# EAGLE design motherboard (EAGLE 5.02)
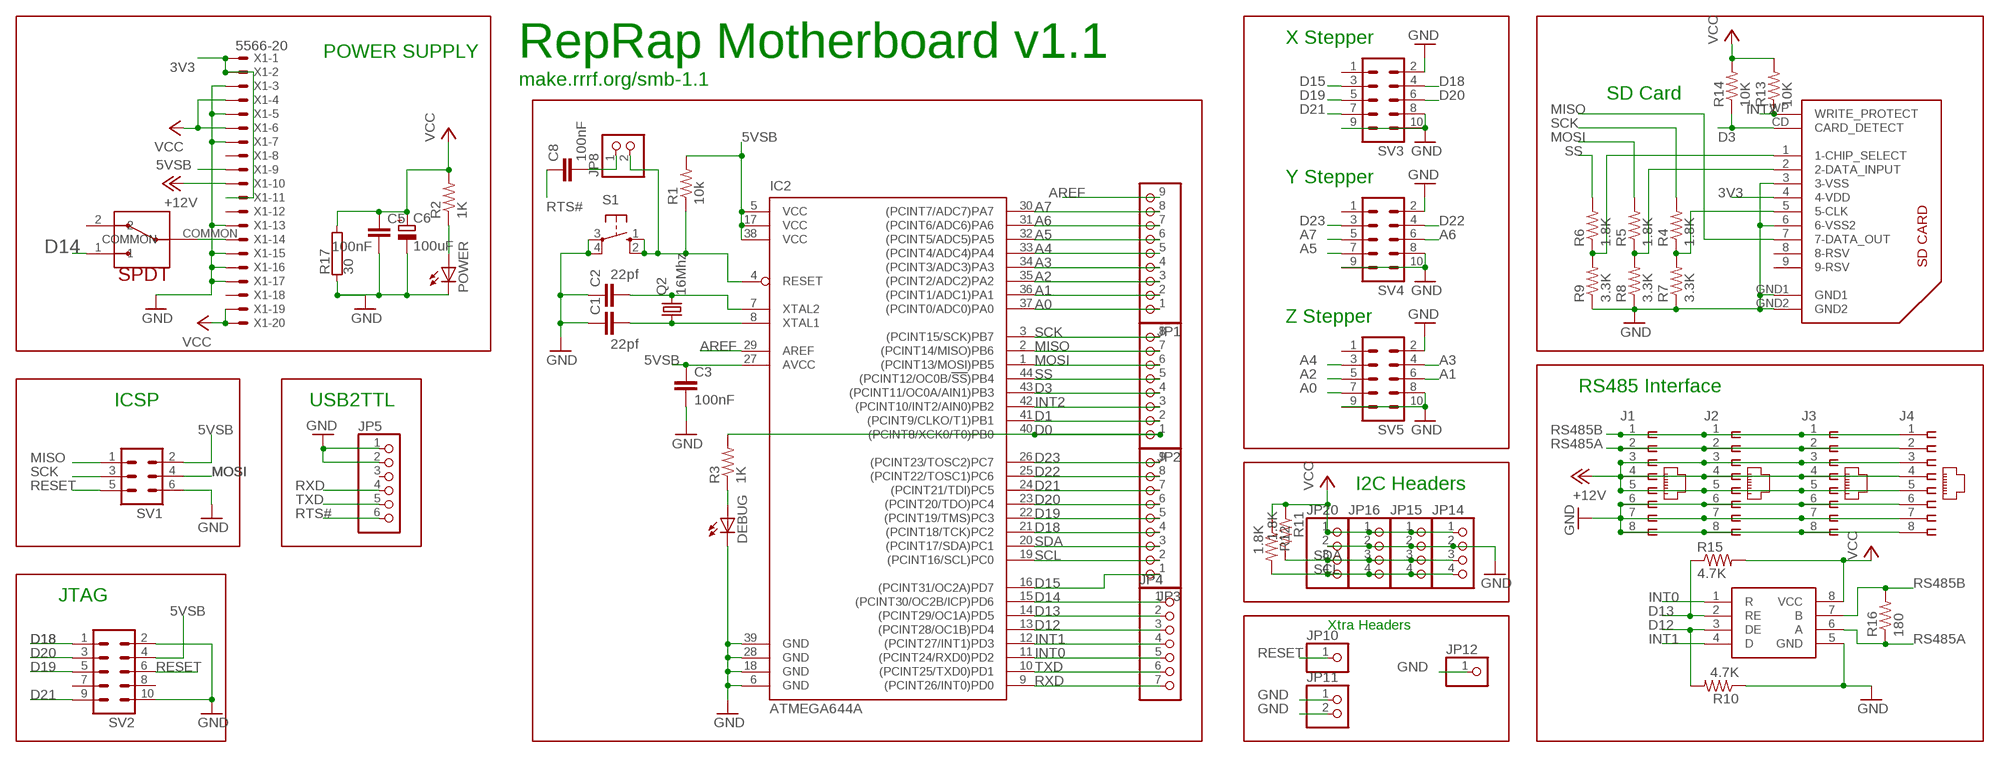
[diagram p0: schematic, sheet 1]

## Parts
C1  22pf  C-EUC1206  [C1206]
C2  22pf  C-EUC1206  [C1206]
C3  100nF  C-EUC1206  [C1206]
C5  100nF  C-EUC1206  [C1206]
C6  100uF  CPOL-EUSANYO_SMD_B6  [SANYO-OSCON_SMD_B6]
C8  100nF  C-EUC1206  [C1206]
DEBUG  LEDCHIPLED_1206  [CHIPLED_1206]
IC1  SN75176ASOIC  [SO08]
IC2  ATMEGA644A  [TQFP44]
J1  555164-1  [555164-1]
J2  555164-1  [555164-1]
J3  555164-1  [555164-1]
J4  555164-1  [555164-1]
JP1  PINHD-1X9  [1X09]
JP2  PINHD-1X8  [1X08]
JP3  PINHD-1X9  [1X09]
JP4  PINHD-1X7  [1X07]
JP5  PINHD-1X6  [1X06]
JP8  PINHD-1X2  [1X02]
JP10  PINHD-1X1  [1X01]
JP11  PINHD-1X2  [1X02]
JP12  PINHD-1X1  [1X01]
JP14  PINHD-1X4  [1X04]
JP15  PINHD-1X4  [1X04]
JP16  PINHD-1X4  [1X04]
JP20  PINHD-1X4  [1X04]
POWER  LEDCHIPLED_1206  [CHIPLED_1206]
Q2  16Mhz  CRYSTALHC49UV  [HC49U-V]
R1  10k  R-US_R1206  [R1206]
R2  1K  R-US_R1206  [R1206]
R3  1K  R-US_R1206  [R1206]
R4  1.8K  R-US_R1206  [R1206]
R5  1.8K  R-US_R1206  [R1206]
R6  1.8K  R-US_R1206  [R1206]
R7  3.3K  R-US_R1206  [R1206]
R8  3.3K  R-US_R1206  [R1206]
R9  3.3K  R-US_R1206  [R1206]
R10  4.7K  R-US_R1206  [R1206]
R11  1.8K  R-US_R1206  [R1206]
R12  1.8K  R-US_R1206  [R1206]
R13  10K  R-US_R1206  [R1206]
R14  10K  R-US_R1206  [R1206]
R15  4.7K  R-US_R1206  [R1206]
R16  180  R-US_R1206  [R1206]
R17  30  RKH206-8  [KH206-8]
S1  10-XX  [B3F-10XX]
SV1  ML6  [ML6]
SV2  ML10  [ML10]
SV3  ML10  [ML10]
SV4  ML10  [ML10]
SV5  ML10  [ML10]
U$2  SPDT  [10SP001]
U$8  SDCARD  [3M-SDCARD]
X1  5566-20  [5566-20]

## Nets
3V3: U$8.4(4-VDD) X1.1 X1.2 X1.11
5VSB: C3.1 IC2.5(VCC) IC2.17(VCC) IC2.27(AVCC) IC2.38(VCC) R1.2 SV1.2 SV2.4 X1.9
+12V: J1.3 J1.4 J1.5 J2.3 J2.4 J2.5 J3.3 J3.4 J3.5 J4.3 J4.4 J4.5 X1.10
A0: IC2.37((PCINT0/ADC0)PA0) JP1.1 SV5.7
A1: IC2.36((PCINT1/ADC1)PA1) JP1.2 SV5.6
A2: IC2.35((PCINT2/ADC2)PA2) JP1.3 SV5.5
A3: IC2.34((PCINT3/ADC3)PA3) JP1.4 SV5.4
A4: IC2.33((PCINT4/ADC4)PA4) JP1.5 SV5.3
A5: IC2.32((PCINT5/ADC5)PA5) JP1.6 SV4.7
A6: IC2.31((PCINT6/ADC6)PA6) JP1.7 SV4.6
A7: IC2.30((PCINT7/ADC7)PA7) JP1.8 SV4.5
AREF: IC2.29(AREF) JP1.9
D0: IC2.40((PCINT8/XCK0/T0)PB0) JP2.1 R3.2
D1: IC2.41((PCINT9/CLKO/T1)PB1) JP2.2
D3: IC2.43((PCINT11/OC0A/AIN1)PB3) JP2.4 R14.1 U$8.CD(CARD_DETECT)
D12: IC1.3(DE) IC2.13((PCINT28/OC1B)PD4) JP4.3 R10.2
D13: IC1.2(RE) IC2.14((PCINT29/OC1A)PD5) JP4.2 R15.1
D14: IC2.15((PCINT30/OC2B/ICP)PD6) JP4.1 U$2.1
D15: IC2.16((PCINT31/OC2A)PD7) JP3.1 SV3.3
D18: IC2.21((PCINT18/TCK)PC2) JP3.4 SV2.1 SV3.4
D19: IC2.22((PCINT19/TMS)PC3) JP3.5 SV2.5 SV3.5
D20: IC2.23((PCINT20/TDO)PC4) JP3.6 SV2.3 SV3.6
D21: IC2.24((PCINT21/TDI)PC5) JP3.7 SV2.9 SV3.7
D22: IC2.25((PCINT22/TOSC1)PC6) JP3.8 SV4.4
D23: IC2.26((PCINT23/TOSC2)PC7) JP3.9 SV4.3
GND [power]: C1.1 C2.1 C3.2 C5.2 C6.- DEBUG.C IC1.5(GND) IC2.6(GND) IC2.18(GND) IC2.28(GND) IC2.39(GND) J1.6 J1.7 J1.8 J2.6 J2.7 J2.8 J3.6 J3.7 J3.8 J4.6 J4.7 J4.8 JP5.1 JP5.2 JP11.1 JP11.2 JP12.1 JP14.2 JP15.2 JP16.2 JP20.2 POWER.C R7.1 R8.1 R9.1 R10.1 R17.1 S1.3(P) S1.4(P1) SV1.6 SV2.2 SV2.10 SV3.2 SV3.8 SV3.9 SV3.10 SV4.2 SV4.8 SV4.9 SV4.10 SV5.2 SV5.8 SV5.9 SV5.10 U$8.3(3-VSS) U$8.6(6-VSS2) U$8.GND1 U$8.GND2 X1.3 X1.5 X1.7 X1.13 X1.15 X1.16 X1.17
INT0: IC1.1(R) IC2.11((PCINT24/RXD0)PD2) JP4.5
INT1: IC1.4(D) IC2.12((PCINT27/INT1)PD3) JP4.4
INT2: IC2.42((PCINT10/INT2/AIN0)PB2) JP2.3 R13.1 U$8.WP(WRITE_PROTECT)
MISO: IC2.2((PCINT14/MISO)PB6) JP2.7 SV1.1 U$8.7(7-DATA_OUT)
MOSI: IC2.1((PCINT13/MOSI)PB5) JP2.6 R5.2 SV1.4
N$1: C2.2 IC2.7(XTAL2) Q2.2
N$4: POWER.A R2.1
N$5: U$2.COMMON X1.14
N$7: DEBUG.A R3.1
N$8: C1.2 IC2.8(XTAL1) Q2.1
N$14: R6.1 R9.2 U$8.1(1-CHIP_SELECT)
N$17: R5.1 R8.2 U$8.2(2-DATA_INPUT)
N$21: C8.2 JP8.1
N$23: R4.1 R7.2 U$8.5(5-CLK)
RESET: IC2.4(RESET) JP8.2 JP10.1 R1.1 S1.1(S) S1.2(S1) SV1.5 SV2.6
RS485A: IC1.6(A) J1.2 J2.2 J3.2 J4.2 R16.1
RS485B: IC1.7(B) J1.1 J2.1 J3.1 J4.1 R16.2
RTS#: C8.1 JP5.6
RXD: IC2.9((PCINT26/INT0)PD0) JP4.7 JP5.4
SCK: IC2.3((PCINT15/SCK)PB7) JP2.8 R4.2 SV1.3
SCL: IC2.19((PCINT16/SCL)PC0) JP3.2 JP14.4 JP15.4 JP16.4 JP20.4 R12.2
SDA: IC2.20((PCINT17/SDA)PC1) JP3.3 JP14.3 JP15.3 JP16.3 JP20.3 R11.2
SS: IC2.44((PCINT12/OC0B/!SS!)PB4) JP2.5 R6.2
TXD: IC2.10((PCINT25/TXD0)PD1) JP4.6 JP5.5
VCC [power]: C5.1 C6.+ IC1.8(VCC) JP14.1 JP15.1 JP16.1 JP20.1 R2.2 R11.1 R12.1 R13.2 R14.2 R15.2 R17.2 X1.4 X1.6 X1.19 X1.20
Unconnected: JP5.3 SV2.7 SV2.8 SV3.1 SV4.1 SV5.1 U$2.2 U$8.8(8-RSV) U$8.9(9-RSV) X1.8 X1.12 X1.18

## Notes on the sheet
- X Stepper
- POWER SUPPLY | RepRap Motherboard v1.1
- make.rrrf.org/smb-1.1
- SD Card
- Y Stepper
- Z Stepper
- RS485 Interface
- ICSP | USB2TTL
- I2C Headers
- JTAG
- Xtra Headers

## Library data of the parts
C1-C3 C5 C8 = rcl:C-EU: CAPACITOR, European symbol
C6 = rcl:CPOL-EU: POLARIZED CAPACITOR, European symbol
DEBUG POWER = led:LED: LED OSRAM: - CHIPLED LG R971, LG N971, LY N971, LG Q971, LY Q971, LO R971, LY R971 LH N974, LH R974 LS Q976, LO Q976, LY Q976 LO Q996 - Hyper CHIPLED LW Q18S LB Q993, LB Q99A, LB R99A - SideLED LS A670, LO A670, LY A670, LG A670, LP A670 LB A673, LV A673, LT A673, LW A673 LH A674 LY A675 LS A676, LA A676, LO A676, LY A676, LW A676 LS A679, LY A679, LG A679 - Hyper Micro SIDELED® LS Y876, LA Y876, LO Y876, LY Y876 LT Y87S - SmartLED LW L88C, LW L88S LB L89C, LB L89S, LG L890 LS L89K, LO L89K, LY L89K LS L896, LA L896, LO L896, LY L896 - TOPLED LS T670, LO T670, LY T670, LG T670, LP T670 LSG T670, LSP T670, LSY T670, LOP T670, LYG T670 LG T671, LOG T671, LSG T671 LB T673, LV T673, LT T673, LW T673 LH T674 LS T676, LA T676, LO T676, LY T676, LB T676, LH T676, LSB T676, LW T676 LB T67C, LV T67C, LT T67C, LS T67K, LO T67K, LY T67K, LW E67C LS E67B, LA E67B, LO E67B, LY E67B, LB E67C, LV E67C, LT E67C LW T67C LS T679, LY T679, LG T679 LS T770, LO T770, LY T770, LG T770, LP T770 LB T773, LV T773, LT T773, LW T773 LH T774 LS E675, LA E675, LY E675, LS T675 LS T776, LA T776, LO T776, LY T776, LB T776 LHGB T686 LT T68C, LB T68C - Hyper Mini TOPLED® LB M676 - Mini TOPLED Santana® LG M470 LS M47K, LO M47K, LY M47K Source: http://www.osram.convergy.de - LUMILED® LXK2-PW12-R00, LXK2-PW12-S00, LXK2-PW14-U00, LXK2-PW14-V00 LXK2-PM12-R00, LXK2-PM12-S00, LXK2-PM14-U00 LXK2-PE12-Q00, LXK2-PE12-R00, LXK2-PE12-S00, LXK2-PE14-T00, LXK2-PE14-U00 LXK2-PB12-K00, LXK2-PB12-L00, LXK2-PB12-M00, LXK2-PB14-N00, LXK2-PB14-P00, LXK2-PB14-Q00 LXK2-PR12-L00, LXK2-PR12-M00, LXK2-PR14-Q00, LXK2-PR14-R00 LXK2-PD12-Q00, LXK2-PD12-R00, LXK2-PD12-S00 LXK2-PH12-R00, LXK2-PH12-S00 LXK2-PL12-P00, LXK2-PL12-Q00, LXK2-PL12-R00 Source: www.luxeon.com
IC1 = reprap:SN75176A
IC2 = atmel:ATMEGA644: 8-bit Microcontroller with 64K Bytes In-System Programmable Flash Source: http://www.atmel.com/dyn/resources/prod_documents/doc2593.pdf
J1-J4 = con-amp:555164-1: AMP connector
JP1 JP3 = pinhead:PINHD-1X9: PIN HEADER
JP2 = pinhead:PINHD-1X8: PIN HEADER
JP4 = pinhead:PINHD-1X7: PIN HEADER
JP5 = pinhead:PINHD-1X6: PIN HEADER
JP8 JP11 = pinhead:PINHD-1X2: PIN HEADER
JP10 JP12 = pinhead:PINHD-1X1: PIN HEADER
JP14-JP16 JP20 = pinhead:PINHD-1X4: PIN HEADER
Q2 = SparkFun:CRYSTAL: Crystals Various standard crystals. Proven footprints. Spark Fun Electronics SKU : COM-00534
R1 R2 R10-R16 = rcl:R-US_: RESISTOR, American symbol
R3-R9 = resistor:R-US_: RESISTOR, American symbol
R17 = resistor-power:R: Power Resitor
S1 = switch-omron:10-XX: OMRON SWITCH
SV1 = con-harting-ml:ML6: HARTING
SV2 SV3 = con-harting-ml:ML10: HARTING
SV4 SV5 = con-ml:ML10: HARTING
U$2 = nycr:SPDT
U$8 = reprap:SDCARD
X1 = con-molex:5566-20: Mini FIT connector 20 pol ATX PC-Motherboard Power connector Source: http://www.molex.com

## Net classes
0 default: width 0.406 mm, clearance 0.305 mm
1 power: width 0.635 mm, clearance 0.406 mm

## Board
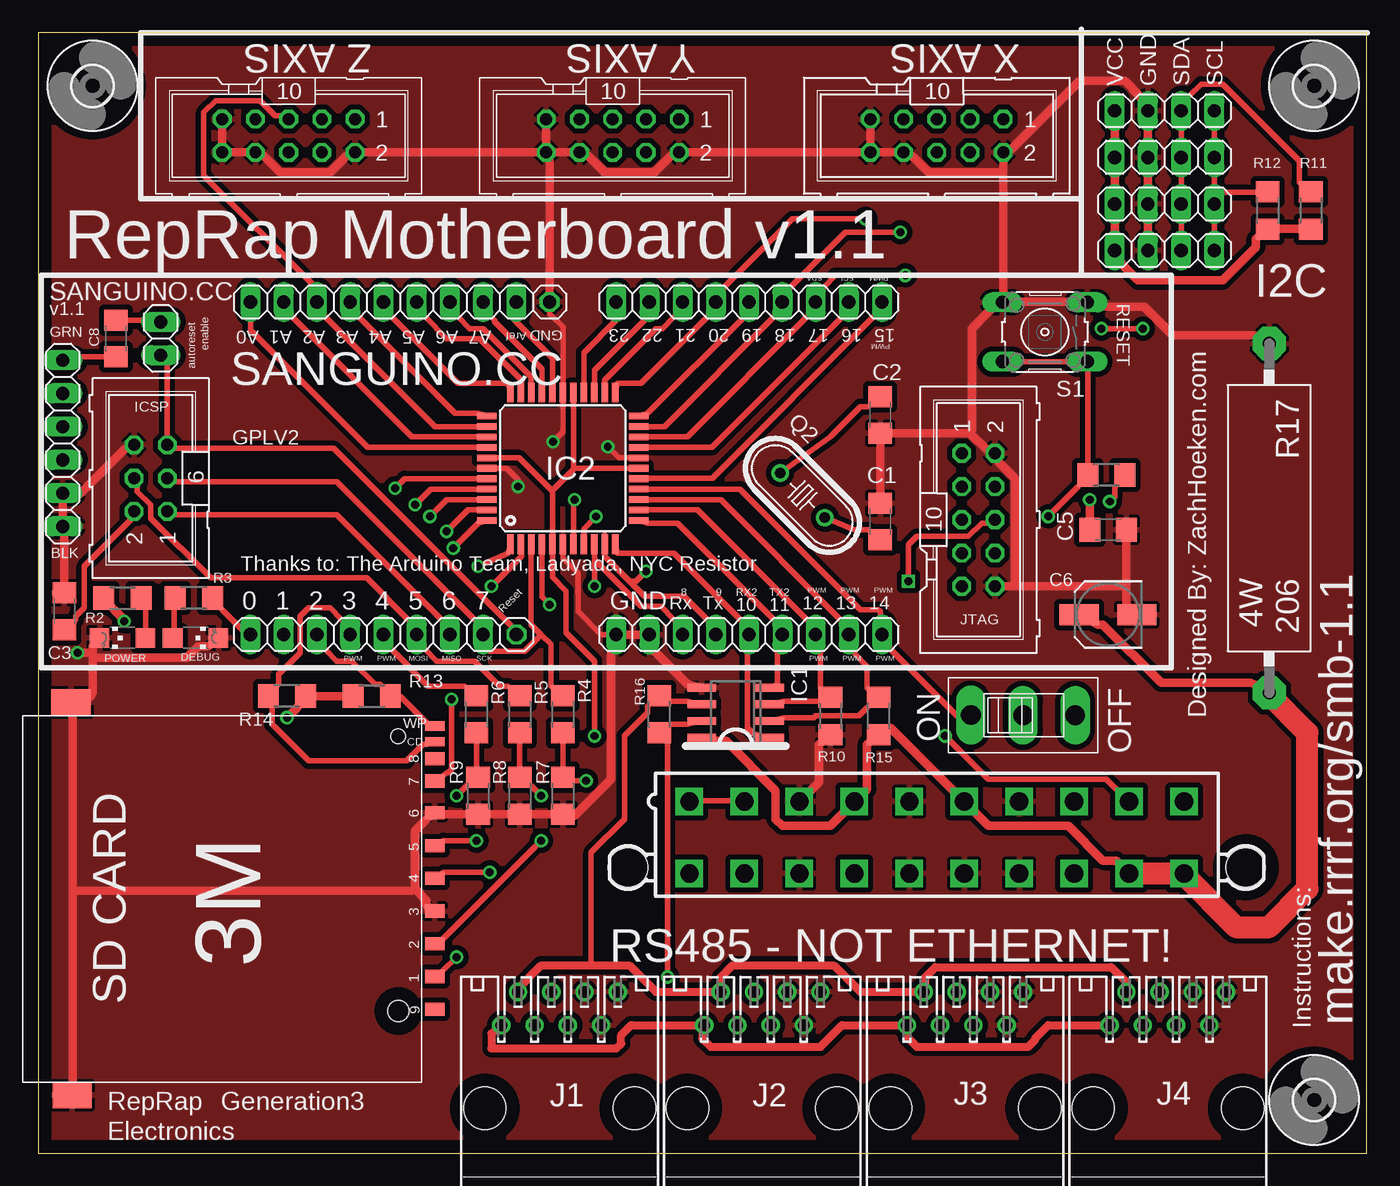
[diagram p1: board, top side]
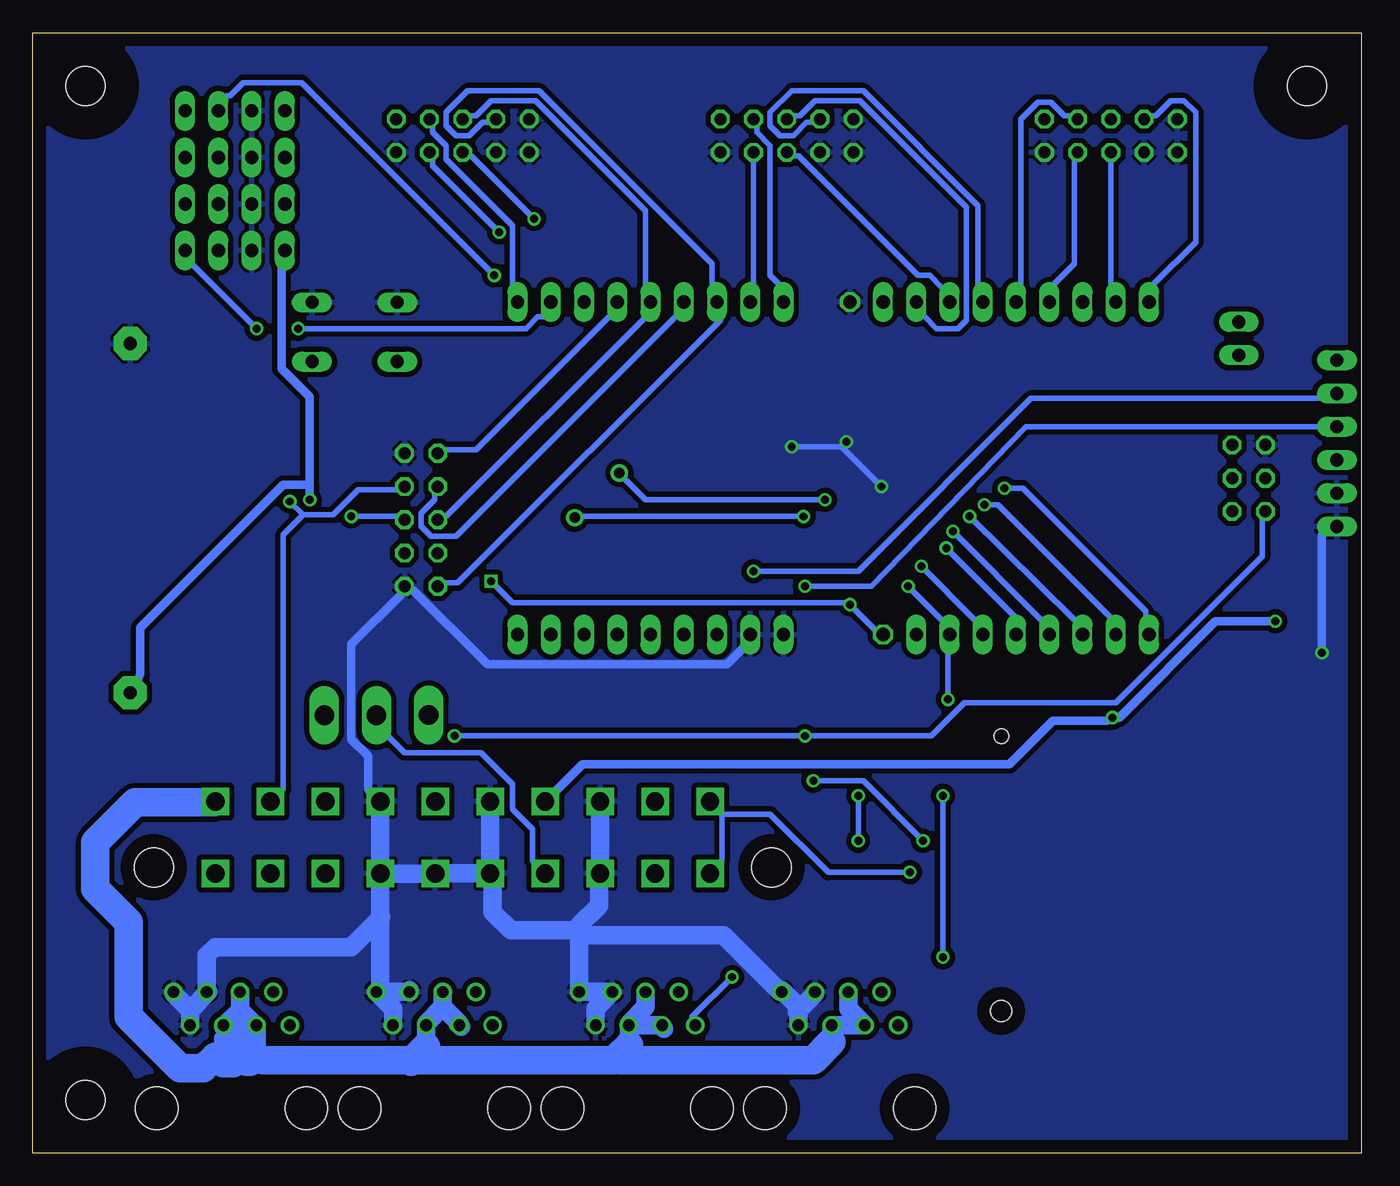
[diagram p2: board, bottom side, seen from below]

Size 101.52 x 85.59 mm. Coordinates in mm from the lower left corner, seen from the top.
Outline: 0,0 101.52,0 101.52,85.59 0,85.59 0,0
Copper layers (1*16): Top 0.035mm / dielectric 1.5mm / Bottom 0.035mm
Design rules "default *": minimum track width 10mil, minimum drill 24mil, track to track 8mil, track to pad 8mil, pad to pad 8mil, via to via 8mil, smd to smd 8mil, copper to edge 40mil, drill to drill 8mil, minimum pad ring 10mil, minimum via ring 8mil, stop-mask expansion 4mil, vias tented up to drill 0mil, thermal gap 10mil

### Footprints (pad centres in the part's own frame; a part is rotated, then mirrored left to right if it is on the bottom)
C1206 = smd 1.6 x 1.8: 1 -1.4,0; 2 1.4,0
SANYO-OSCON_SMD_B6 = smd 3 x 1.6: + 2.2,0; - -2.2,0
CHIPLED_1206 = smd 1.5 x 1.5: A 0,-1.75; C 0,1.75
SO08 = smd 0.6 x 2.2: 1 -1.905,-2.6; 2 -0.635,-2.6; 3 0.635,-2.6; 4 1.905,-2.6; 5 1.905,2.6; 6 0.635,2.6; 7 -0.635,2.6; 8 -1.905,2.6
TQFP44 = smd 1.5 x 0.5: 1 -5.8,4; 2 -5.8,3.2; 3 -5.8,2.4; 4 -5.8,1.6; 5 -5.8,0.8; 6 -5.8,0; 7 -5.8,-0.8; 8 -5.8,-1.6; 9 -5.8,-2.4; 10 -5.8,-3.2; 11 -5.8,-4; 23 5.8,-4; 24 5.8,-3.2; 25 5.8,-2.4; 26 5.8,-1.6; 27 5.8,-0.8; 28 5.8,0; 29 5.8,0.8; 30 5.8,1.6; 31 5.8,2.4; 32 5.8,3.2; 33 5.8,4 | smd 0.5 x 1.5: 12 -4,-5.8; 13 -3.2,-5.8; 14 -2.4,-5.8; 15 -1.6,-5.8; 16 -0.8,-5.8; 17 0,-5.8; 18 0.8,-5.8; 19 1.6,-5.8; 20 2.4,-5.8; 21 3.2,-5.8; 22 4,-5.8; 34 4,5.8; 35 3.2,5.8; 36 2.4,5.8; 37 1.6,5.8; 38 0.8,5.8; 39 0,5.8; 40 -0.8,5.8; 41 -1.6,5.8; 42 -2.4,5.8; 43 -3.2,5.8; 44 -4,5.8
555164-1 = drill 0.889 round: 1 -4.445,5.207; 2 -3.175,7.747; 3 -1.905,5.207; 4 -0.635,7.747; 5 0.635,5.207; 6 1.905,7.747; 7 3.175,5.207; 8 4.445,7.747 | hole 3.251: -5.715,-1.143; 5.715,-1.143
1X09 = drill 1.016 long: 1 -10.16,0; 2 -7.62,0; 3 -5.08,0; 4 -2.54,0; 5 0,0; 6 2.54,0; 7 5.08,0; 8 7.62,0; 9 10.16,0
1X08 = drill 1.016 long: 1 -8.89,0; 2 -6.35,0; 3 -3.81,0; 4 -1.27,0; 5 1.27,0; 6 3.81,0; 7 6.35,0; 8 8.89,0
1X07 = drill 1.016 long: 1 -7.62,0; 2 -5.08,0; 3 -2.54,0; 4 0,0; 5 2.54,0; 6 5.08,0; 7 7.62,0
1X06 = drill 1.016 long: 1 -6.35,0; 2 -3.81,0; 3 -1.27,0; 4 1.27,0; 5 3.81,0; 6 6.35,0
1X02 = drill 1.016 long: 1 -1.27,0; 2 1.27,0
1X01 = drill 1.016 octagon: 1 0,0
1X04 = drill 1.016 long: 1 -3.81,0; 2 -1.27,0; 3 1.27,0; 4 3.81,0
HC49U-V = drill 0.813 round: 1 -2.413,0; 2 2.413,0
R1206 = smd 1.6 x 1.803: 1 -1.422,0; 2 1.422,0
KH206-8 = drill 1.016 pad 2.54 octagon: 1 -13.335,0; 2 13.335,0
B3F-10XX = drill 1.016 long: 1 -3.251,2.261; 2 3.251,2.261; 3 -3.251,-2.261; 4 3.251,-2.261
ML6 = drill 0.914 octagon: 1 -2.54,-1.27; 2 -2.54,1.27; 3 0,-1.27; 4 0,1.27; 5 2.54,-1.27; 6 2.54,1.27
ML10 = drill 0.914 octagon: 1 -5.08,-1.27; 2 -5.08,1.27; 3 -2.54,-1.27; 4 -2.54,1.27; 5 0,-1.27; 6 0,1.27; 7 2.54,-1.27; 8 2.54,1.27; 9 5.08,-1.27; 10 5.08,1.27
10SP001 = drill 1.5 long: 1 1.71,2.86; 2 9.69,2.85; COMMON 5.7,2.85
3,0 = hole 3: 0,0
3M-SDCARD = smd 1 x 1.5: 1 5.93,16.5; 2 3.43,16.5; 3 0.93,16.5; 4 -1.57,16.5; 5 -4.07,16.5; 6 -6.57,16.5; 7 -9,16.5; 8 -10.7,16.5; 9 8.43,16.5 | smd 0.7 x 1.5: CD -12,16.5; WP -13.2,16.5 | smd 2 x 3: GND1 -15,-11.3; GND2 15,-11.2 | hole 1.1: -12.427,13.705 | hole 1.6: 8.567,13.708
5566-20 = drill 1.4 square: 1 18.9,-2.75; 2 14.7,-2.75; 3 10.5,-2.75; 4 6.3,-2.75; 5 2.1,-2.75; 6 -2.1,-2.75; 7 -6.3,-2.75; 8 -10.5,-2.75; 9 -14.7,-2.75; 10 -18.9,-2.75; 11 18.9,2.75; 12 14.7,2.75; 13 10.5,2.75; 14 6.3,2.75; 15 2.1,2.75; 16 -2.1,2.75; 17 -6.3,2.75; 18 -10.5,2.75; 19 -14.7,2.75; 20 -18.9,2.75 | hole 3: 23.6,2.29; -23.6,2.29

### Placement (x,y rotation side)
C1  64.35,48.26 270 top
C2  64.35,56.38 90 top
C3  1.99,41.4 90 top
C5  81.75,47.62 0 top
C6  81.75,41.14 180 top
C8  5.93,62.23 90 top
DEBUG  12.03,39.37 270 top
IC1  53.3,33.65 90 top
IC2  40.09,52.32 90 top
J1  39.84,4.57 0 top
J2  55.33,4.57 0 top
J3  70.83,4.57 0 top
J4  86.32,4.57 0 top
JP1  26.38,65.02 0 top
JP2  25.11,39.62 0 top
JP3  54.32,65.02 180 top
JP4  56.86,39.62 180 top
JP5  1.87,54.22 90 top
JP8  9.36,62.23 270 top
JP10  36.54,39.62 0 top
JP11  45.43,39.62 180 top
JP12  39.08,65.02 0 top
JP14  86.07,72.51 0 top
JP15  86.07,76.07 0 top
JP16  86.07,79.62 0 top
JP20  86.07,68.96 0 top
POWER  6.44,39.37 90 top
Q2  58.4,50.25 135 top
R1  81.62,51.81 0 top
R2  6.44,42.41 180 top
R3  11.9,42.41 0 top
R4  40.09,33.52 90 top
R5  36.79,33.52 90 top
R6  33.49,33.52 90 top
R7  40.09,27.3 90 top
R8  36.79,27.3 90 top
R9  33.62,27.3 90 top
R10  60.54,33.4 90 top
R11  97.24,72 90 top
R12  93.94,72 90 top
R13  25.49,34.92 180 top
R14  19.01,34.92 0 top
R15  64.22,33.4 270 top
R16  47.46,33.52 270 top
R17  94.07,48.51 270 top
S1  76.92,62.73 180 top
SV1  8.6,51.56 90 top
SV2  71.84,48.38 270 top
SV3  68.67,77.72 180 top
SV4  43.9,77.72 180 top
SV5  19.14,77.72 180 top
U$2  69.56,30.6 0 top
U$3  [3,0]  4.15,81.53 0 top
U$4  [3,0]  97.5,81.53 0 top
U$5  [3,0]  97.5,4.06 0 top
U$8  13.81,19.43 270 top
X1  68.67,24.12 180 top

### Tracks (layer width: path | path; a pad name or v marks a point on that pad's centre or on a via)
3V3  (via drill 0.61)
  Top 0.406: v34.51,21.46 30.95,21.46 U$8.4 | X1.2 52.92,26.92 50.76,26.92 X1.1
  Bottom 0.406: v34.51,21.46 40.73,21.46 45.17,25.9 48.73,25.9 | 48.73,25.9 X1.1 | X1.11 48.86,22.35 48.86,25.78 48.73,25.9
5VSB  (via drill 0.6, 0.61)
  Top 0.406: C3.1 2.88,40.76 2.88,41.02 3.52,41.65 3.52,44.83 7.07,48.38 SV1.2 | v81.88,49.78 82.26,50.16 82.26,50.92 R1.2 | v69.3,31.87 72.61,28.57 81.62,28.57 82.39,27.81 X1.9 | 39.29,50.63 IC2.5 39.29,43.98 40.35,42.92 40.35,39.75 42.51,37.59 v42.51,31.87 | 39.29,50.63 40.86,52.19 | 40.86,52.19 40.98,52.32 IC2.17 | IC2.27 40.89,52.23 40.86,52.19 | 39.29,50.63 39.24,50.63 36.75,53.12 IC2.38
  Bottom 0.406: 80.86,48.76 v81.88,49.78 | 80.86,48.76 78.58,48.76 76.67,50.67 73.75,50.67 SV2.4 | X1.9 82.39,27.81 82.39,47.24 80.86,48.76 | v69.3,31.87 v42.51,31.87 42.13,31.87 32.86,31.87 30.31,34.41 18.76,34.41 7.58,45.59 7.58,48.38 SV1.2
+12V
  Bottom 1.422: J1.4 39.21,11.04 J1.3 J1.5 40.48,8.5 | 53.3,9.52 53.43,9.65 J2.3 J2.5 | J2.5 55.97,9.9 54.7,11.17 J2.4 | 55.97,8.25 J2.5 | J3.3 69.05,9.9 | J3.3 68.8,9.65 | J3.3 68.92,9.9 70.19,11.17 | 70.19,11.17 J3.4 | 70.19,11.17 71.46,9.9 J3.5 71.46,8.12 | 83.91,7.11 84.42,7.61 J4.3 84.54,9.77 85.69,10.92 | J4.5 86.96,9.65 85.69,10.92 | 85.69,10.92 J4.4 85.69,7.74 84.92,6.98 | 85.18,6.98 86.96,8.76 86.96,7.61 86.2,6.85
  Bottom 1.778: 87.47,7.36 87.59,7.36 | X1.10 87.57,26.9 87.59,26.92 87.72,26.79
  Bottom 2.184: 40.48,8.5 41.87,7.11 56.6,7.11 56.86,7.36 | 56.86,7.36 55.97,8.25 | 56.86,7.36 57.11,7.11 72.48,7.11 | 72.48,7.11 71.46,8.12 | 72.48,7.11 72.61,7.11 | 72.61,7.11 83.91,7.11 | 84.92,6.98 85.18,6.98 | 86.2,6.85 86.96,6.85 87.47,7.36 | 87.59,7.36 88.48,6.47 90.26,6.47 94.2,10.41 94.2,17.65 96.74,20.19 96.74,23.74 93.69,26.79 87.72,26.79 | 72.61,7.11 72.61,6.98 72.48,7.11
A0
  Top 0.406: IC2.37 25.16,53.92 16.22,62.86 JP1.1
  Bottom 0.406: SV5.7 15.96,79.24 15.71,79.24 14.57,80.39 13.55,80.39 12.66,79.5 12.66,69.59 15.84,66.42 JP1.1
A1
  Top 0.406: IC2.36 33.62,54.73 28.54,54.73 19.39,63.88 JP1.2
  Bottom 0.406: SV5.6 19.14,66.42 JP1.2
A2
  Top 0.406: IC2.35 33.62,55.49 30.31,55.49 21.93,63.88 JP1.3 20.92,66.42 12.66,74.67 12.66,79.5 13.55,80.39 16.98,80.39 18.12,79.24 18.5,79.24 SV5.5
A3
  Top 0.406: IC2.34 33.62,56.51 31.84,56.51 24.47,63.88 JP1.4
  Bottom 0.406: SV5.4 21.93,75.81 21.93,67.94 23.46,66.42 JP1.4
A4
  Top 0.406: IC2.33 35.9,58.8 32.09,58.8 27.01,63.88 JP1.5
  Bottom 0.406: SV5.3 22.31,79.24 22.7,79.24 23.71,80.26 24.73,80.26 26,78.99 26,66.42 JP1.5
A5
  Top 0.406: IC2.32 36.92,58.8 36.92,59.05 33.74,62.23 31.2,62.23 29.55,63.88 JP1.6
  Bottom 0.406: SV4.7 42,78.73 42.38,78.73 43.4,77.72 44.41,77.72 45.17,78.48 45.17,79.5 43.52,81.15 38.06,81.15 29.3,72.38 29.3,66.42 JP1.6
A6
  Top 0.406: IC2.31 37.68,58.8 37.68,59.3 34,62.99 32.98,62.99 32.09,63.88 JP1.7
  Bottom 0.406: SV4.6 43.27,76.19 43.02,76.19 33.87,67.05 32.98,67.05 32.09,66.16 JP1.7
A7
  Top 0.406: IC2.30 38.49,59.89 34.89,63.5 34.89,63.62 33.87,64.64 34,64.77 JP1.8
  Bottom 0.406: SV4.5 43.27,79.24 42.89,79.24 41.75,80.39 38.32,80.39 30.19,72.26 30.19,63.62 30.82,62.99 32.47,62.99 33.36,63.88 JP1.8
AREF
  Top 0.406: IC2.29 39.29,60.74 36.41,63.62 36.41,65.15 JP1.9
D0  (via drill 0.6)
  Top 0.406: R3.2 14.06,41.52 15.58,40 JP2.1 | IC2.40 27.99,51.52 v27.27,50.8
  Bottom 0.406: v27.27,50.8 25.87,50.8 16.47,41.4 16.47,39.87 JP2.1 16.09,39.49
D1  (via drill 0.6)
  Top 0.406: IC2.41 29.98,50.72 v28.79,49.53
  Bottom 0.406: v28.79,49.53 27.77,49.53 18.76,40.51 JP2.2 18.76,39.49
D3  (via drill 0.61)
  Top 0.406: U$8.CD 29.68,31.24 29.43,31.24 28.16,29.97 20.66,29.97 17.87,32.76 17.87,34.03 R14.1 18.38,35.81 18.38,36.57 20.03,38.22 20.03,41.02 20.66,41.65 22.31,41.65 23.2,40.76 JP2.4 | v31.2,47.49 32.86,49.14 33.62,49.14 IC2.43
  Bottom 0.406: v31.2,47.49 24.47,40.76 JP2.4
D12
  Top 0.406: IC1.3 56.98,34.54 59.65,34.54 R10.2 59.78,35.55 59.78,38.22 JP4.3 58.76,40.76 50.38,49.14 46.57,49.14 IC2.13
D13
  Top 0.406: IC2.14 46.57,49.91 52.16,49.91 61.3,40.76 JP4.2 62.32,38.22 63.34,37.21 63.34,35.55 R15.1 63.34,34.03 62.7,33.4 59.4,33.4 59.27,33.27 56.98,33.27 IC1.2
D14
  Top 0.406: U$2.1 70.19,33.4 65.11,38.48 JP4.1 64.48,39.75 64.35,39.87 64.35,41.4 64.22,41.52 62.83,41.52 53.63,50.72 IC2.15
D15
  Top 0.406: IC2.16 46.57,51.56 51.52,51.56 63.84,63.88 JP3.1
  Bottom 0.406: SV3.3 70.95,78.35 70.95,77.97 69.94,76.96 69.94,75.94 64.86,70.86 64.86,66.42 JP3.1
D18  (via drill 0.61)
  Top 0.406: IC2.21 46.57,55.49 47.84,55.49 56.22,63.88 JP3.4 57.49,66.16 61.68,70.35 v65.88,70.35
  Bottom 0.406: SV2.1 69.94,53.72 67.65,53.72 57.49,63.88 JP3.4 | v65.88,70.35 70.95,75.43 70.95,75.81 SV3.4
D19
  Top 0.406: IC2.22 46.57,56.51 53.81,63.75 JP3.5
  Bottom 0.406: SV2.5 69.94,48.64 54.83,63.75 JP3.5 54.7,66.42 54.7,72 63.08,80.39 66.51,80.39 67.65,79.24 68.03,79.24 SV3.5
D20  (via drill 0.61)
  Top 0.406: IC2.23 44.29,58.8 46.06,58.8 51.14,63.88 JP3.6 52.41,66.16 57.62,71.37 v63.21,71.37
  Bottom 0.406: SV2.3 70.83,50.29 70.83,49.91 71.84,48.89 71.84,47.87 71.08,47.11 69.18,47.11 52.41,63.88 JP3.6 | v63.21,71.37 68.03,76.19 SV3.6
D21
  Top 0.406: IC2.24 43.27,58.8 43.27,59.05 47.21,62.99 47.71,62.99 48.6,63.88 JP3.7
  Bottom 0.406: SV2.9 69.94,43.56 69.05,43.56 48.98,63.62 JP3.7 49.62,66.42 49.62,67.94 62.83,81.15 68.29,81.15 69.94,79.5 69.94,78.48 69.18,77.72 68.16,77.72 67.14,78.73 66.76,78.73 SV3.7
D22
  Top 0.406: IC2.25 42.51,58.8 42.51,59.81 46.32,63.62 JP3.8
  Bottom 0.406: SV4.4 46.44,66.42 JP3.8
D23
  Top 0.406: IC2.26 41.69,61.16 44.16,63.62 44.16,64.89 44.29,65.02 JP3.9
  Bottom 0.406: SV4.3 46.19,78.35 46.19,77.97 45.17,76.96 45.17,67.05 44.54,66.42 JP3.9
GND  (via drill 0.6, 0.61)
  Top 0.406: JP12.1 39.08,64.13 40.09,63.11 IC2.28 40.09,55.11 v39.33,54.35 | IC2.6 40.09,45.46 41.24,44.32 41.24,41.4 43.02,39.62 44.03,39.62 44.16,39.49 JP11.2 | IC2.18 44.37,53.12 v43.52,53.97 | v36.66,50.92 36.66,51.43 35.78,52.32 IC2.39 34.25,52.32
  Top 0.635: 2.63,20.06 2.63,4.82 U$8.GND2 | 2.63,20.06 2.63,33.02 U$8.GND1 3.9,34.79 4.03,34.92 4.15,35.17 4.15,37.84 | C3.2 1.99,47.24 JP5.1 JP5.2 3.26,50.41 6.69,53.84 SV1.6 | IC1.5 49.62,35.81 47.08,38.35 JP11.1 JP11.2 43.78,38.22 43.78,28.57 40.98,25.78 R7.1 39.21,25.9 37.68,25.9 R8.1 35.9,25.9 34.51,25.9 R9.1 32.73,25.9 30.95,25.9 U$8.6 29.68,25.52 28.79,24.63 28.79,20.19 | 4.15,37.84 4.15,38.22 | 4.15,38.22 4.15,38.73 POWER.C | DEBUG.C 13.04,38.73 12.28,38.73 11.39,37.84 4.15,37.84 | 28.79,20.19 29.68,19.3 29.68,18.92 U$8.3 | 2.63,20.06 28.54,20.06 28.79,20.19 | 4.15,38.22 v3.01,38.22 | SV5.9 SV5.10 SV5.8 17.23,76.19 18.5,74.92 22.31,74.92 23.58,76.19 SV5.2 SV4.10 | SV4.10 SV4.8 42,76.19 43.27,74.92 47.08,74.92 48.35,76.19 SV4.2 SV3.10 | SV4.10 SV4.9 | JP12.1 39.08,75.81 SV4.10 | R10.1 59.65,31.24 59.65,28.32 59.14,27.81 X1.3 | 83.15,43.3 83.15,41.91 C6.- | 83.15,43.3 83.15,46.73 C5.2 | SV2.10 74.64,43.3 | 74.64,43.3 83.15,43.3 | C1.1 C2.1 65.24,54.99 71.21,54.99 | 71.21,54.99 72.48,53.72 SV2.2 73.37,52.83 74.64,51.56 74.64,43.3 | JP20.2 JP14.2 JP15.2 JP16.2 84.16,80.77 83.02,81.91 79.59,81.91 74.38,76.7 SV3.2 73.75,74.92 | SV3.10 SV3.8 66.76,76.19 68.03,74.92 73.75,74.92 | SV3.10 SV3.9 | 73.75,74.92 73.75,65.65 S1.4 | S1.4 75.15,65.02 78.7,65.02 S1.3 81.62,64.64 84.54,64.64 86.7,62.48 92.93,62.48 R17.1 | 71.21,54.99 71.34,55.24 71.34,62.99 72.61,64.26 S1.4
  Bottom 0.406: 39.71,53.97 v43.52,53.97 | 39.71,53.97 v36.66,50.92 | v39.33,54.35 39.71,53.97
  Bottom 0.635: v3.01,38.22 3.01,47.24 JP5.1 | X1.7 75.91,27.81 75.91,30.35 77.18,31.62 77.18,38.86 73.37,42.67 SV2.10 72.48,43.05 66.76,37.33 48.48,37.33 47.33,38.48 JP11.1
  Bottom 1.422: J3.7 74,11.04 J3.8 75.15,12.31 | J3.6 72.73,12.44 72.86,12.31 75.15,12.31 | 74.97,18.03 74.97,12.49 75.15,12.31 | X1.17 74.97,18.03 | J4.8 90.77,12.19 89.5,10.92 | 89.5,10.92 J4.7 | 89.5,10.92 88.1,12.31 J4.6 88.23,15.11 87.59,15.74 77.18,15.74 74.89,18.03 74.97,18.03 | J2.7 58.51,11.04 J2.6 59.65,12.31 59.78,12.44 | 59.78,12.44 J2.8 | 59.78,17.01 59.78,12.44 | 59.78,17.01 59.78,17.39 58.26,18.92 58.26,21.33 | 58.17,21.54 58.13,21.58 | 58.17,21.54 X1.13 58.21,21.38 58.26,21.33 | 58.26,21.33 58.26,21.46 58.17,21.54 | 43.02,10.79 J1.7 | 43.02,10.79 43.02,11.17 44.29,12.44 J1.8 44.41,12.31 48.73,16.63 59.78,16.63 60.16,17.01 | 43.02,10.79 43.14,10.79 41.75,12.19 J1.6 | 60.16,17.01 59.78,17.01 | X1.3 58.17,21.42 58.26,21.33 | 60.16,17.01 64.99,17.01 66.38,18.41 66.38,21.2 66.55,21.38 X1.15 | 70.91,21.38 X1.16 | 70.91,21.38 X1.15 | 70.91,21.38 70.95,21.33 74.77,21.33 74.97,21.54 | 74.97,21.54 75.02,21.58 | X1.17 74.97,21.54 | X1.17 X1.7 74.97,27 75.02,27.05 | 66.57,26.99 X1.5 | X1.15 66.57,26.99 | 66.57,26.99 66.38,27.17
  pour Top: -1.56,86.61 102.58,86.61 102.58,-1.02 -1.56,-1.02
  pour Bottom: -1.56,86.61 102.58,86.61 102.58,-1.02 -1.56,-1.02
INT0
  Top 0.406: IC2.11 44.29,45.84 48.6,45.84 53.68,40.76 JP4.5 54.19,38.22 54.19,32.51 54.7,32 54.83,32 IC1.1
INT1
  Top 0.406: IC2.12 46.57,48.13 48.86,48.13 56.22,40.76 JP4.4 56.48,38.22 56.48,35.81 IC1.4
INT2  (via drill 0.61)
  Top 0.406: U$8.WP 29.68,32.89 27.65,34.92 R13.1 26.12,35.81 25.74,35.81 23.96,37.59 22.82,37.59 21.93,38.48 JP2.3 | 33.62,49.91 IC2.42 34.27,49.92 34.25,49.91 31.2,49.91 v29.93,48.64
  Bottom 0.406: v29.93,48.64 21.93,40.76 JP2.3
MISO  (via drill 0.61)
  Top 0.406: v31.58,34.67 31.58,29.33 31.33,29.08 31.2,29.08 30.95,28.82 U$8.7 | v34.63,43.3 36.92,45.59 36.92,45.84 IC2.2 | SV1.1 10.5,48.76 22.82,48.76 30.82,40.76 JP2.7
  Bottom 0.406: v31.58,34.67 31.58,38.22 JP2.7 32.09,40.76 v34.63,43.3
MOSI  (via drill 0.61)
  Top 0.406: v33.62,44.83 35.9,45.84 IC2.1 | R5.2 35.9,35.68 35.27,35.68 33.36,37.59 30.44,37.59 29.55,38.48 JP2.6 28.28,40.76 25.11,43.94 13.17,43.94 8.6,48.51 8.6,49.53 7.58,50.54 7.58,50.92 SV1.4
  Bottom 0.406: v33.62,44.83 29.55,40.76 JP2.6
N$1  (via drill 0.6)
  Top 0.406: C2.2 63.46,57.02 62.83,57.02 60.54,54.73 Q2.2 | IC2.7 40.89,49.82 v40.98,49.91
  Bottom 0.406: Q2.2 56.71,51.96 56.73,51.94 54.7,49.91 v40.98,49.91
N$4
  Top 0.406: POWER.A 8.22,40 8.22,41.52 R2.1
N$5
  Bottom 0.406: X1.14 63.34,22.35 63.34,24.76 64.86,26.28 64.86,28.19 67.27,30.6 73.11,30.6 74.26,31.74 U$2.COMMON
N$7
  Top 0.406: DEBUG.A 10.38,40 10.38,41.52 R3.1
N$8  (via drill 0.6)
  Top 0.406: C1.2 63.46,47.62 62.32,47.62 60.29,48.51 Q2.1 | IC2.8 41.69,47.7 v42.63,48.64
  Bottom 0.406: 60.13,48.54 60.16,48.51 | 60.13,48.54 Q2.1 | v42.63,48.64 60.03,48.64 60.13,48.54
N$14  (via drill 0.61)
  Top 0.406: v31.97,14.98 30.95,13.96 U$8.1 | v31.97,27.3 32.73,28.06 R9.2 33.49,29.46 R6.1
  Bottom 0.406: v31.97,14.98 v31.97,27.3
N$17  (via drill 0.61)
  Top 0.406: v38.44,23.87 30.95,16.38 U$8.2 | v38.44,27.3 37.68,28.06 R8.2 R5.1
  Bottom 0.406: v38.44,23.87 v38.44,27.3
N$21
  Top 0.406: C8.2 6.82,63.62 7.96,63.62 JP8.1
N$23  (via drill 0.61)
  Top 0.406: v33.49,23.87 30.95,23.87 U$8.5 | v41.87,28.44 40.98,28.44 R7.2 R4.1
  Bottom 0.406: v33.49,23.87 38.06,28.44 v41.87,28.44
RESET  (via drill 0.6, 0.61)
  Top 0.406: v77.18,48.64 79.46,50.92 R1.1 80.23,52.7 80.23,59.81 S1.1 78.7,60.45 75.15,60.45 S1.2 | JP8.2 9.87,60.32 SV1.5 10.5,53.84 22.57,53.84 36.16,40.25 JP10.1 | SV2.6 72.48,48.13 72.1,48.13 71.08,47.11 67.14,47.11 66.51,46.48 v66.51,43.68 | IC2.4 38.49,42.49 v39.08,41.91
  Bottom 0.406: v77.18,48.64 73.75,48.64 SV2.6 | JP10.1 37.17,40 38.7,41.52 v39.08,41.91 39.21,42.03 64.86,42.03 v66.51,43.68
RS485A
  Top 0.406: IC1.6 49.62,34.54 48.35,34.54 R16.1 46.57,34.16 46.57,33.65 44.79,31.87 44.79,25.52 42.25,22.98 42.25,14.35
  Top 0.61: J4.2 83.15,13.08 82,14.22 68.54,14.22 67.78,13.46 67.78,12.57 67.65,12.44 J3.2 62.83,12.31 60.8,14.35 53.05,14.35 52.16,13.46 52.16,12.44 52.03,12.31 J2.2 47.21,12.31 45.17,14.35 42.25,14.35 38.44,14.35 36.54,12.44 J1.2
RS485B  (via drill 0.61)
  Top 0.406: IC1.7 49.62,32.76 48.35,32.76 R16.2 48.09,31.36 v48.09,13.46
  Top 0.61: J4.1 77.18,9.77 76.16,8.76 76.16,8.63 75.65,8.12 67.14,8.12 66.38,8.88 66.38,9.52 66.26,9.65 J3.1 61.43,9.77 59.78,8.12 51.4,8.12 50.76,8.76 50.76,9.52 51.02,9.77 J2.1 45.3,9.77 44.54,9.01 44.54,8.38 44.16,8 34.63,8 34.63,9.14 35.27,9.77 J1.1
  Bottom 0.406: v48.09,13.46 51.14,10.41 J2.1
RTS#
  Top 0.406: C8.1 5.04,60.83 3.26,60.83 JP5.6
RXD  (via drill 0.6)
  Top 0.406: 42.51,45.33 42.51,45.84 IC2.9 | 42.51,45.33 46.06,41.78 47.59,41.78 48.6,40.76 JP4.7 | v42.51,43.3 42.51,45.33
  Bottom 0.406: JP5.4 25.62,55.49 37.43,43.3 v42.51,43.3
SCK
  Top 0.406: 38.44,39.62 39.21,38.86 39.21,35.68 R4.2 | 38.44,39.62 37.68,40.38 37.68,45.84 IC2.3 | SV1.3 10.5,51.3 22.82,51.3 33.36,40.76 JP2.8 34.51,38.35 37.17,38.35 38.44,39.62
SCL  (via drill 0.61)
  Top 0.406: R12.2 93.05,73.4 90.51,73.4 JP14.4 | JP16.4 JP15.4 JP14.4 | v81.24,62.99 v84.42,62.99 | JP20.4 JP14.4 | IC2.19 51.47,53.92 61.56,64 61.56,64.64 JP3.2
  Bottom 0.406: v81.24,62.99 63.84,62.99 62.95,63.88 62.57,63.88 JP3.2 | v84.42,62.99 89.24,67.81 JP20.4
SDA  (via drill 0.61)
  Top 0.406: JP20.3 JP14.3 JP15.3 JP16.3 87.97,80.77 88.86,81.66 90.51,81.66 96.36,75.81 96.36,74.16 R11.2 | IC2.20 46.57,54.73 49.62,54.73 58.76,63.88 JP3.3 60.03,66.16 60.92,67.05 v66.26,67.05
  Bottom 0.406: v66.26,67.05 80.99,81.78 85.43,81.78 86.45,80.77 86.7,80.77 JP16.3
SS  (via drill 0.61)
  Top 0.406: v31.71,46.22 33.62,48.13 IC2.44 | R6.2 32.6,35.68 29.81,35.68 27.01,38.48 JP2.5
  Bottom 0.406: v31.71,46.22 26.5,41.02 JP2.5
TXD  (via drill 0.6)
  Top 0.406: 43.27,45.59 43.27,45.84 IC2.10 43.27,47.24 43.27,45.59 | 45.17,43.68 46.32,42.54 49.37,42.54 51.14,40.76 JP4.6 | 45.17,43.68 43.27,45.59 | 45.17,43.68 45.68,43.68 v46.44,44.45
  Bottom 0.406: JP5.5 3.26,57.65 25.23,57.65 38.44,44.45 v46.44,44.45
VCC  (via drill 0.61)
  Top 0.635: R17.2 92.93,35.81 92.67,35.94 85.81,35.94 81.37,40.38 80.99,40.38 C6.+ | JP16.1 JP15.1 JP14.1 JP20.1 82.89,67.81 84.04,66.67 90.51,66.67 93.05,69.21 93.05,69.84 R12.1 94.83,70.61 96.36,70.61 R11.1 | v80.35,49.91 80.35,48.51 C5.1 | R13.2 R14.2 19.77,34.03 v19.01,33.27 | v6.57,40.64 6.57,40.76 5.8,41.52 R2.2 | IC1.8 51.78,31.49 52.54,31.49 56.35,27.68 56.35,25.52 56.86,25.01 60.54,25.01 61.43,25.9 X1.4 63.34,27.81 63.34,31.24 R15.2 65.11,32.51 69.81,27.81 X1.6 71.72,25.9 72.61,25.01 78.7,25.01 81.37,22.35 82.39,22.35 X1.19
  Top 1.676: 87.47,21.46 87.55,21.38 X1.20 | X1.19 87.38,21.38 87.47,21.46 | 87.47,21.46 87.47,21.33 91.53,17.27 94.07,17.27 96.99,20.19 96.99,32.13 93.94,35.17 R17.2
  Bottom 0.635: R17.2 93.43,36.32 93.31,36.57 93.31,40.13 82.39,51.05 80.35,51.05 | 80.35,51.05 80.35,57.78 82.51,59.94 82.51,67.56 JP20.1 | 80.35,51.05 v80.35,49.91 | v6.57,40.64 11.14,40.64 18.5,33.27 v19.01,33.27 19.39,33.02 23.58,33.02 26.89,29.71 59.53,29.71 61.43,27.81 X1.4

### Text on the board
tPlace: Z AXIS | Y AXIS | X AXIS | VCC | GND | SDA | SCL | RepRap Motherboard v1.1 | I2C | SDA | SCL | PWM | SANGUINO.CC | RESET | v1.1 | A0 | A1 | A2 | A3 | A4 | A5 | A6 | A7 | GND | 23 | 22 | 21 | 20 | 19 | 18 | 17 | 16 | 15 | GRN | Aref | PWM | enable | autoreset | SANGUINO.CC | ICSP | GPLV2 | BLK | Thanks to: The Arduino Team, Ladyada, NYC Resistor | PWM | PWM | PWM | 8 | 9 | RX2 | TX2 | 0 | 1 | 2 | 3 | 4 | 5 | 6 | 7 | Reset | GND | Rx | Tx | 10 | 11 | 12 | 13 | 14 | JTAG | C3 | PWM | PWM | MOSI | MISO | SCK | PWM | PWM | PWM | ON | OFF | Designed By: ZachHoeken.com | RS485 - NOT ETHERNET! | make.rrrf.org/smb-1.1 | Instructions: | RepRap | Generation3 | Electronics